# Altium project CAN card.PrjPcb
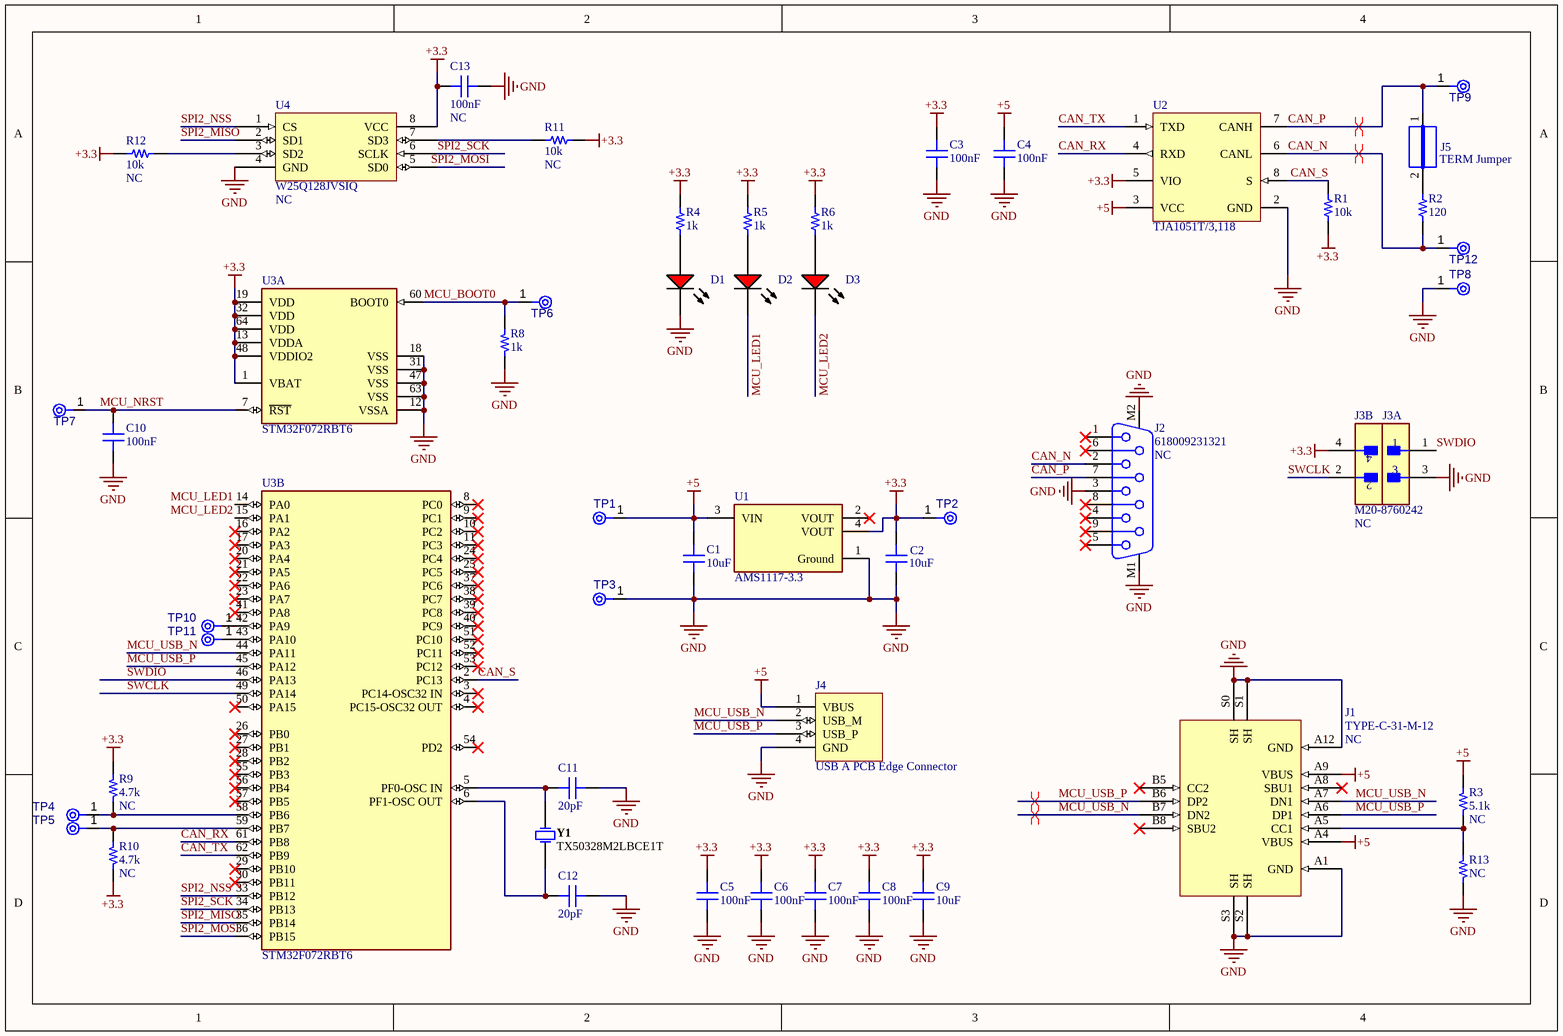
[diagram p0: Sheet1.SchDoc]
1 sheet, 50 parts. Net scope: global (net labels, ports and power ports of the same name join across sheets).
Board file: PCB1.PcbDoc

## Sheet Sheet1.SchDoc
size A4; SheetNumber: 1; SheetTotal: 1

### Parts
C1  value 10uF  [CAPC0603(1608)100_L]  (hidden comment: Capacitor)
C2  value 10uF  [CAPC0603(1608)100_L]  (hidden comment: Capacitor)
C3  value 100nF  [CAPC0402(1005)33_L]  (hidden comment: Capacitor)
C4  value 100nF  [CAPC0402(1005)33_L]  (hidden comment: Capacitor)
C5  value 100nF  [CAPC0402(1005)33_L]  (hidden comment: Capacitor)
C6  value 100nF  [CAPC0402(1005)33_L]  (hidden comment: Capacitor)
C7  value 100nF  [CAPC0402(1005)33_L]  (hidden comment: Capacitor)
C8  value 100nF  [CAPC0402(1005)33_L]  (hidden comment: Capacitor)
C9  value 10uF  [CAPC0603(1608)100_L]  (hidden comment: Capacitor)
C10  value 100nF  [CAPC0402(1005)33_L]  (hidden comment: Capacitor)
C11  value 20pF  [CAPC0402(1005)33_L]  (hidden comment: Capacitor)
C12  value 20pF  [CAPC0402(1005)33_L]  (hidden comment: Capacitor)
C13  value 100nF  Not Populated: NC  [CAPC0402(1005)33_L]  (hidden comment: Capacitor)
D1  TLMS1100-GS08  [VISH-TLMX1100_V]  (value not drawn)
D2  TLMS1100-GS08  [VISH-TLMX1100_V]  (value not drawn)
D3  TLMS1100-GS08  [VISH-TLMX1100_V]  (value not drawn)
J1  TYPE-C-31-M-12  Not Populated: NC  [TYPE-C-31-M-12-Footprint-1]
J2  618009231321  Not Populated: NC  [618009231321]
J3  M20-8760242  [FP-M20-8760242-MFG]  (value not drawn)  (parts A,B of 2)
J4  USB A PCB Edge Connector  [USB A PCB Edge Connector-Footprint-1]  (no BOM)
J5  Not Populated: TERM Jumper  [JUMPER]  (hidden comment: JUMPER)  (no BOM)
R1  value 10k  [RESC0402(1005)_L]  (hidden comment: Resistor)
R2  value 120  [RESC0603(1608)_L]  (hidden comment: Resistor)
R3  value 5.1k  Not Populated: NC  [RESC0603(1608)_L]  (hidden comment: Resistor)  (no BOM)
R4  value 1k  [RESC0402(1005)_L]  (hidden comment: Resistor)
R5  value 1k  [RESC0402(1005)_L]  (hidden comment: Resistor)
R6  value 1k  [RESC0402(1005)_L]  (hidden comment: Resistor)
R8  value 1k  [RESC0402(1005)_L]  (hidden comment: Resistor)
R9  value 4.7k  Not Populated: NC  [RESC0603(1608)_L]  (hidden comment: Resistor)
R10  value 4.7k  Not Populated: NC  [RESC0603(1608)_L]  (hidden comment: Resistor)
R11  value 10k  Not Populated: NC  [RESC0402(1005)_L]  (hidden comment: Resistor)
R12  value 10k  Not Populated: NC  [RESC0402(1005)_L]  (hidden comment: Resistor)
R13  Not Populated: NC  [RESC0603(1608)_L]  (hidden comment: Resistor)  (no BOM)
TP1  Test Point  [New footprint 1]  (value not drawn)  (no BOM)
TP2  Test Point  [New footprint 1]  (value not drawn)  (no BOM)
TP3  Test Point  [New footprint 1]  (value not drawn)  (no BOM)
TP4  Test Point  [New footprint 1]  (value not drawn)  (no BOM)
TP5  Test Point  [New footprint 1]  (value not drawn)  (no BOM)
TP6  Test Point  [New footprint 1]  (value not drawn)  (no BOM)
TP7  Test Point  [New footprint 1]  (value not drawn)  (no BOM)
TP8  Test Point  [New footprint 1]  (value not drawn)  (no BOM)
TP9  Test Point  [New footprint 1]  (value not drawn)  (no BOM)
TP10  Test Point  [New footprint 1]  (value not drawn)  (no BOM)
TP11  Test Point  [New footprint 1]  (value not drawn)  (no BOM)
TP12  Test Point  [New footprint 1]  (value not drawn)  (no BOM)
U1  AMS1117-3.3  [FP-AMS1117-IPC_A]
U2  TJA1051T/3,118  [NXP-SOIC-8_L]
U3  STM32F072RBT6  [FP-LQFP64-5W-MFG]  (parts A,B of 2)
U4  W25Q128JVSIQ  Not Populated: NC  [WINBOND SOIC-8 208MIL WIDE]
Y1  TX50328M2LBCE1T  [FP-ABM3-MFG]

### Nets
+3.3: C2.2 C3.2 C5.2 C6.2 C7.2 C8.2 C9.2 C13.2 J3.4 R1.2 R4.2 R5.2 R6.2 R9.2 R10.1 R11.2 R12.1 TP2.1(TP) U1.4(VOUT) U2.5(VIO) U3.1(VBAT) U3.13(VDDA) U3.19(VDD) U3.32(VDD) U3.48(VDDIO2) U3.64(VDD) U4.8(VCC)
+5: C1.2 C4.2 J1.A4(VBUS) J1.A9(VBUS) J4.1(VBUS) R3.1 TP1.1(TP) U1.3(VIN) U2.3(VCC)
GND: C1.1 C2.1 C3.1 C4.1 C5.1 C6.1 C7.1 C8.1 C9.1 C10.1 C11.1 C12.1 C13.1 D1.2(K) J1.A1(GND) J1.A12(GND) J1.S0(SH) J1.S1(SH) J1.S2(SH) J1.S3(SH) J2.3 J2.M1 J2.M2 J3.3 J4.4(GND) R8.1 R13.1 TP3.1(TP) TP8.1(TP) U1.1(Ground) U2.2(GND) U3.12(VSSA) U3.18(VSS) U3.31(VSS) U3.47(VSS) U3.63(VSS) U4.4(GND)
CAN_N: J2.2 R2.2 TP12.1(TP) U2.6(CANL)
CAN_P: J2.7 J5.1 TP9.1(TP) U2.7(CANH)
CAN_RX: U2.4(RXD) U3.61(PB8)
CAN_S: R1.1 U2.8(S) U3.2(PC13)
CAN_TX: U2.1(TXD) U3.62(PB9)
MCU_BOOT0: R8.2 TP6.1(TP) U3.60(BOOT0)
MCU_LED1: D2.2(K) U3.14(PA0)
MCU_LED2: D3.2(K) U3.15(PA1)
MCU_NRST: C10.2 TP7.1(TP) U3.7(~{RST})
MCU_USB_N: J1.A7(DN1) J1.B7(DN2) J4.2(USB_M) U3.44(PA11)
MCU_USB_P: J1.A6(DP1) J1.B6(DP2) J4.3(USB_P) U3.45(PA12)
SPI2_MISO: U3.35(PB14) U4.2(SD1)
SPI2_MOSI: U3.36(PB15) U4.5(SD0)
SPI2_NSS: U3.33(PB12) U4.1(CS)
SPI2_SCK: U3.34(PB13) U4.6(SCLK)
SWCLK: J3.2 U3.49(PA14)
SWDIO: J3.1 U3.46(PA13)
NetC11_2: C11.2 U3.5(PF0-OSC_IN) Y1.2
NetC12_2: C12.2 U3.6(PF1-OSC_OUT) Y1.1
NetD1_1: D1.1(A) R4.1
NetD2_1: D2.1(A) R5.1
NetD3_1: D3.1(A) R6.1
NetJ1_A5: J1.A5(CC1) R3.2 R13.2
NetJ5_2: J5.2 R2.1
NetR9_1: R9.1 TP4.1(TP) U3.58(PB6)
NetR10_2: R10.2 TP5.1(TP) U3.59(PB7)
NetR11_1: R11.1 U4.7(SD3)
NetR12_2: R12.2 U4.3(SD2)
NetTP10_1: TP10.1(TP) U3.42(PA9)
NetTP11_1: TP11.1(TP) U3.43(PA10)

Not connected (* = marked no-connect by the designer): J1 A8(SBU1)* B5(CC2)* B8(SBU2)*; J2 1* 4* 5* 6* 8* 9*; U1 2(VOUT)*; U3 3(PC14-OSC32_IN)* 4(PC15-OSC32_OUT)* 8(PC0)* 9(PC1)* 10(PC2)* 11(PC3)* 16(PA2)* 17(PA3)* 20(PA4)* 21(PA5)* 22(PA6)* 23(PA7)* 24(PC4)* 25(PC5)* 26(PB0)* 27(PB1)* 28(PB2)* 29(PB10)* 30(PB11)* 37(PC6)* 38(PC7)* 39(PC8)* 40(PC9)* 41(PA8)* 50(PA15)* 51(PC10)* 52(PC11)* 53(PC12)* 54(PD2)* 55(PB3)* 56(PB4)* 57(PB5)*

### Layout directives
differential pair: CAN_N, CAN_P, MCU_USB_N, MCU_USB_P

### Library data of the parts
C1-C13 = CMP-001-00089-1: Generic Capacitor; Pins: 2
D1-D3 = CMP-1666-00027-1: LED, RED, 2.1 V, -40 to 100 degC, 2-Pin SMD (0603), RoHS, Tape and Reel; Type (Capacitors): C0G; Resistance: 100000000000 Ohm; Capacitance: 12 pF; Voltage Rating: 50 V; Tolerance: 5%; Min Operating Temperature: -55degC; REACH SVHC: No SVHC; ComponentLink2Description: Datasheet; ComponentLink1URL: http://www.vishay.com/; Width: 0.8 mm; Package Quantity: 4000; PackageReference: TLMX1100; ComponentLink2URL: http://www.vishay.com/docs/83173/tlmb1100.pdf; Case/Package: 0603; Case Code (Metric): 1608; Packaging: Tape and Reel; Pins: 2; ComponentLink1Description: Manufacturer URL; Max Operating Temperature: 125degC; Height: 0.8 mm; Length: 1.6 mm; Mount: Surface Mount; PackageDescription: 2-Pin Surface Mount Device, Body 1.6 x 0.8 mm; DatasheetVersion: Rev. 2.7, 03/2016; Case Code (Imperial): 0603; Voltage Rating (DC): 50 V; RoHSCompliant: True; Radiation Hardening: No
J1 = CMP-002-00095-1: USB Type C USB 2.0; Gender: Female; Max Current Rating: 5A; Pins: 16; Mounting Technology: SMD; Connector Type: USB Type C
J2 = CMP-1502-00204-2: NexarPartId: 12259390; Contact Resistance: 30mΩ; Current Rating: 3A; Insulation Resistance: 5GΩ; Voltage Rating: 125V; Pitch: 2.77mm; Gender: Female; Number of Contacts: 9; Number of Rows: 2; Insulation Material: PBT; Orientation: Right Angle; Termination: SMD/SMT; Min Operating Temperature: -55°C; RoHS: Compliant; Max Operating Temperature: 105°C; Lead Free: Lead Free; Housing Material: Steel; Number of Pins: 9; Depth: 20.75mm; Contact Plating: Gold; Width: 12.5mm; Operating Supply Voltage: 125V; REACH SVHC: Unknown; Mount: Through Hole; Length: 16.34mm
J3 = CMP-15831-000048-1: CONN HEADER SMD 4POS 2.54MM; Contact Resistance: 25mR; Max Current Rating: 3A; Row Spacing: 0.1inch; Gender: Male; Number of Contacts: 4; Connector Type: Male Pin; Contact Mating Length: 0.228inch; Max Operating Temperature: 105°C; Depth: 5.08mm; Contact Material: Bronze; Packaging: Bulk; Series: M20; Radiation Hardening: No; Length: 5.08mm; Contact Type: Male Pin; Housing Material: Nylon; Pitch: 2.54mm; Color: Black; RoHS Compliant: Yes; Package Quantity: 1000; Orientation: Straight; Housing Color: Black; Min Operating Temperature: -40°C; Termination: Solder; Contact Plating: Gold; Mount: Surface Mount; Number of Rows: 2; Number of Positions: 4; Not Populated: N/A
J4 = CMP-002-00096-1
J5 = CMP-009-00061-2: Pins: 2
R1-R6 R8-R13 = CMP-009-00196-1: Generic Resistor; Pins: 2
TP1-TP12 = CMP-000000-1
U1 = CMP-209535-000001-1: LDO Voltage Regulators 1A, 3.3V; Manufacturer: Advanced Monolithic Systems; Dropout Voltage: 1.1V; Output Type: Fixed; Nominal Supply Current: 5mA; Max Power Dissipation: 1.2W; Max Supply Voltage: 15V; Number Of Outputs: 1; Standoff Height: 0.64mm; Max Junction Temp: +125°C; Height: 1.8mm; Package: AMS1117; Device Class L2: Power Management ICs; ComponentLink2Description: Datasheet; ComponentLink2URL: http://www.advanced-monolithic.com/pdf/ds1117.pdf; Category: IC; RoHS: TRUE; Automotive: No; Device Class L1: Integrated Circuits (ICs); Output Current: 1A; Device Class L3: Voltage Regulators - Linear; Temperature: -40°C to +125°C; Output Voltage: 3.3V; Manufacturer Part Number: AMS1117-3.3; Temperature Range Low: -40°C; Octopart: https://octopart.com/ams1117-3.3-advanced+monolithic+systems-25899300; Lead Free: Yes; Ipc Land Pattern Name: SOT229P700X180-4; Temperature Range High: +125°C
U2 = CMP-2000-07245-1: High-Speed CAN Transceiver, 3 to 5 V, 8-Pin SOIC (SOT96-1), RoHS, Tape and Reel; Manufacturer: NXP; Power Down Mode: Normal/Silent; Rad Hardened: No; Number of Transceivers: 1; Supply Current: 70mA; Operating Supply Voltage (Max): 5.5V; Operating Supply Voltage (Typ): 5V; Operating Supply Voltage (Min): 4.5V; Standard Supported: ISO11898-2; Data Rate: 1Mbps; DELETED: Compliant; Operating Temperature (Min): -40C; Datasheet Version: Rev. 7, 01/2015; Pin Count: 8; Operating Temperature (Max): 125C; Package Description: 8-Pin Small Outline Integrated Circuit, Body 4.9 x 3.9 mm, Pitch 1.27 mm; Category: Transceiver; Packaging: TapeandReel; Mounting: SurfaceMount; Package Reference: SOT96-1; Operating Temperature Classification: Automotive; Mounting Technology: SurfaceMount; Package Type: SO; Manufacturer URL: http://www.nxp.com/; Datasheet URL: http://www.nxp.com/documents/data_sheet/TJA1051.pdf
U3 = CMP-0304-00181-3: IC MCU 32BIT 128KB FLASH 64LQFP; Manufacturer: STMicroelectronics; Ram Size: 16KBytes; Number Of Usb Channels: 1; Number Of Timers/Counters: 9; Max Supply Voltage: 3.6V; Min Supply Voltage: 1.65V; Number Of Adc Channels: 19; Number Of Spi Channels: 2; Number Of I/Os: 51; Max Junction Temp: +105°C; Number Of Pwm Channels: 18; Interface: I2C,SPI,USART,CAN,USB,LIN,IrDA,I2S,Other; Standoff Height: 0.05mm; Number Of Uart Channels: 4; Frequency: 48MHz; Data Bus Width: 32bits; Core Architecture: ARM Cortex-M0; Memory Size: 128KBytes; Digikey Description: IC MCU 32BIT 128KB FLASH 64LQFP; Number Of A/D Converters: 1; Device Class L2: Embedded Processors and Controllers; ComponentLink2URL: https://www.st.com/resource/en/datasheet/stm32f072rb.pdf; Ambient Temperature Range Low: -40°C; Temperature Range High: +105°C; Device Class L3: Microcontrollers; Manufacturer Part Number: STM32F072RBT6; RoHS: TRUE; Ambient Temperature Range High: +85°C; Temperature Range Low: -40°C; Lead Free: Yes; Height: 1.6mm; Number Of I2C Channels: 2; Temperature: -40°C to +105°C; ComponentLink2Description: Datasheet; Device Class L1: Integrated Circuits (ICs); Automotive: No; Memory Type: FLASH; Octopart: https://octopart.com/stm32f072rbt6-stmicroelectronics-34084849; Number Of Cores: 1; Mouser Description: ARM Microcontrollers - MCU 16/32-BITS MICROS; Package: LQFP64-5W; Category: IC
U4 = CMP-019-00063-1: Flash, 16MX8, PDSO8; Memory Size: 16777216; Max Supply Voltage: 3.6V; Clock Frequency: 133MHz; Min Supply Voltage: 3V; Case/Package: SOP; RoHS Compliant: Yes; Pins: 8; Min Operating Temperature: -40°C; Memory Format: FLASH; Max Operating Temperature: 85°C
Y1 = CMP-003-00031-1: Frequency: 8MHz; Pins: 2; Mounting Technology: SMD; Case/Package: GLASS 5.0*3.22PIN

## Assembly variants
Minimal: not fitted C13 J1 J2 J3 R3 R9 R10 R11 R12 R13 U4
Complete: not fitted R3 R13